# EAGLE schematic panelDoc (EAGLE 6.4)
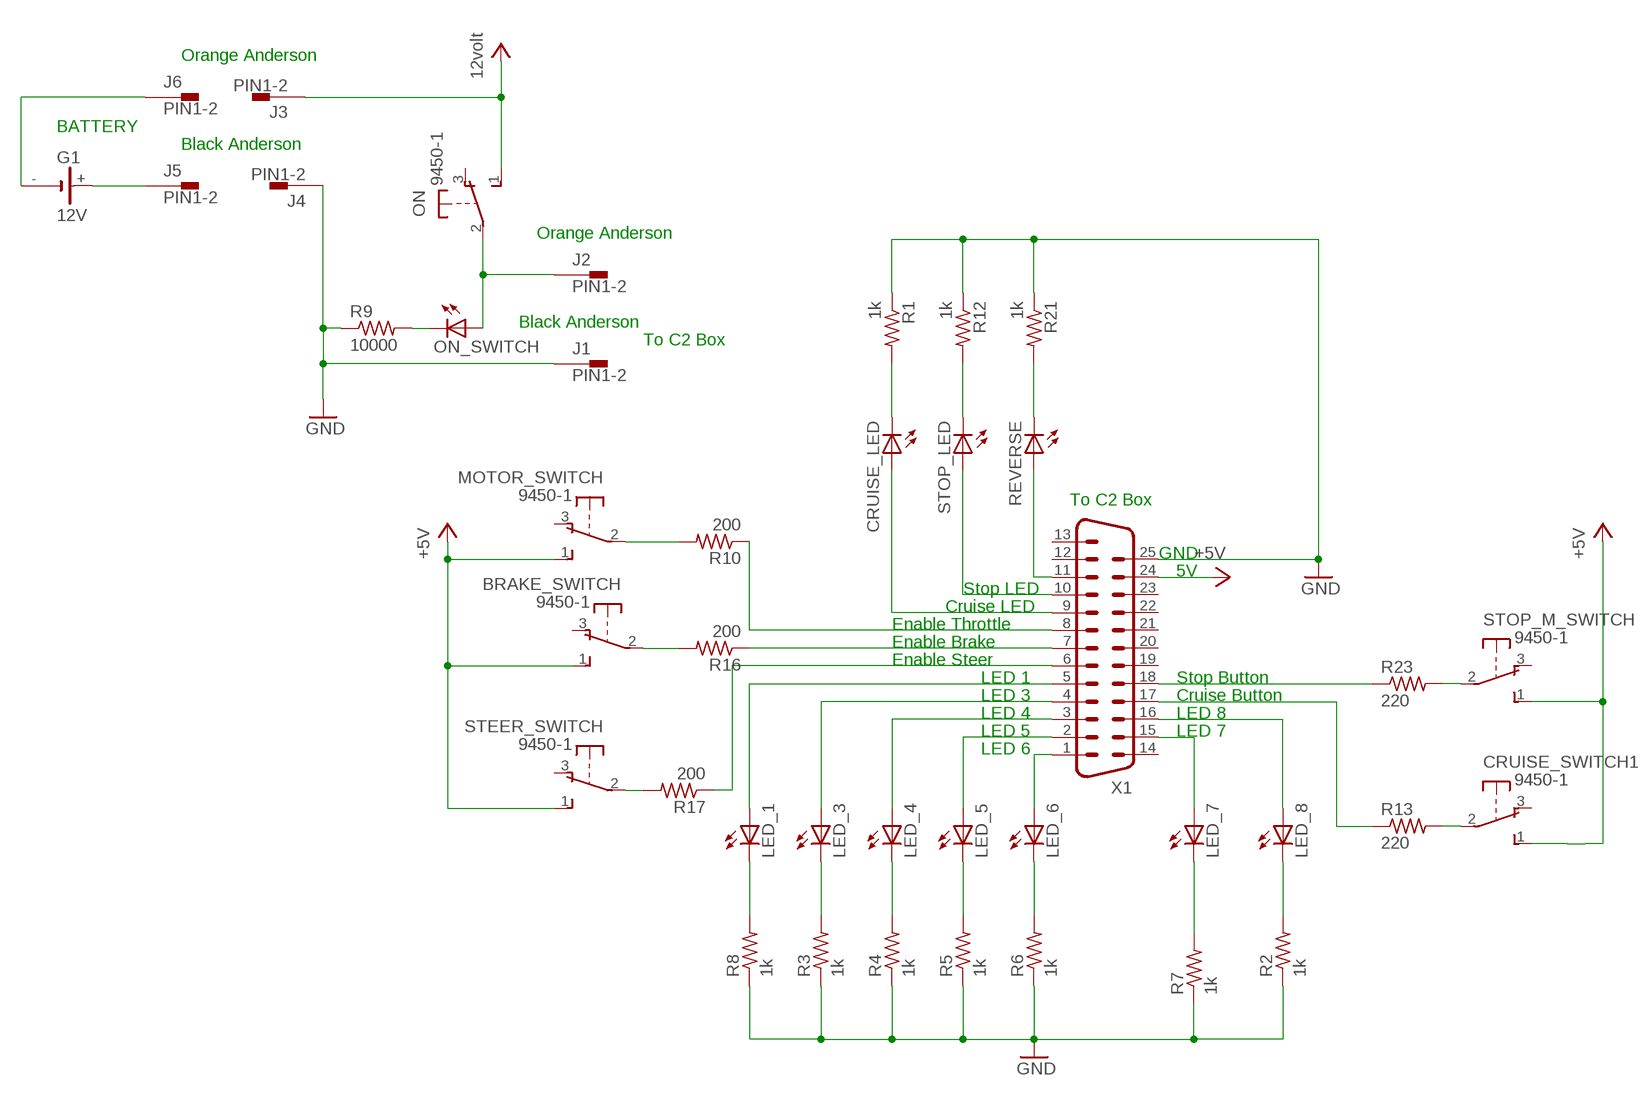
[diagram p0: schematic, sheet 1]

## Parts
BRAKE_SWITCH  9450-1  [9450-1]
CRUISE_LED  LEDB155  [Q62902-B155]
CRUISE_SWITCH1  9450-1  [9450-1]
G1  12V  SL-150-1/2AA/PT  [SL-150-1/2AA/PT]
J1  PIN1-2  [62221]
J2  PIN1-2  [62221]
J3  PIN1-2  [62221]
J4  PIN1-2  [62221]
J5  PIN1-2  [62221]
J6  PIN1-2  [62221]
LED_1  LEDB155  [Q62902-B155]
LED_3  LEDB155  [Q62902-B155]
LED_4  LEDB155  [Q62902-B155]
LED_5  LEDB155  [Q62902-B155]
LED_6  LEDB155  [Q62902-B155]
LED_7  LEDB155  [Q62902-B155]
LED_8  LEDB155  [Q62902-B155]
MOTOR_SWITCH  9450-1  [9450-1]
ON  9450-1  [9450-1]
ON_SWITCH  LEDB155  [Q62902-B155]
R1  1k  R-US_0617/17  [0617/17]
R2  1k  R-US_0617/17  [0617/17]
R3  1k  R-US_0617/17  [0617/17]
R4  1k  R-US_0617/17  [0617/17]
R5  1k  R-US_0617/17  [0617/17]
R6  1k  R-US_0617/17  [0617/17]
R7  1k  R-US_0617/17  [0617/17]
R8  1k  R-US_0617/17  [0617/17]
R9  10000  R-US_0617/17  [0617/17]
R10  200  R-US_0617/17  [0617/17]
R12  1k  R-US_0617/17  [0617/17]
R13  220  R-US_0617/17  [0617/17]
R16  200  R-US_0617/17  [0617/17]
R17  200  R-US_0617/17  [0617/17]
R21  1k  R-US_0617/17  [0617/17]
R23  220  R-US_0617/17  [0617/17]
REVERSE  LEDB155  [Q62902-B155]
STEER_SWITCH  9450-1  [9450-1]
STOP_LED  LEDB155  [Q62902-B155]
STOP_M_SWITCH  9450-1  [9450-1]
X1  M25-182  [182-025-MALE]

## Nets
+5V: BRAKE_SWITCH.1(S) CRUISE_SWITCH1.1(S) J3.1 MOTOR_SWITCH.1(S) ON.1(S) STEER_SWITCH.1(S) STOP_M_SWITCH.1(S) X1.24 ; supply symbol labelled 12volt
GND: J1.1 J4.1 R1.1 R2.1 R3.1 R4.1 R5.1 R6.1 R7.1 R8.1 R9.1 R12.1 R21.1 X1.25
N$1: R17.1 X1.6
N$2: LED_8.K(C) R2.2
N$3: CRUISE_LED.K(C) R1.2
N$4: LED_3.K(C) R3.2
N$5: LED_3.A X1.4
N$6: LED_4.K(C) R4.2
N$7: LED_4.A X1.3
N$8: LED_1.A X1.5
N$9: LED_8.A X1.16
N$10: LED_5.K(C) R5.2
N$11: LED_5.A X1.2
N$12: LED_6.K(C) R6.2
N$13: LED_6.A X1.1
N$14: LED_7.K(C) R7.2
N$15: CRUISE_LED.A X1.9
N$16: LED_1.K(C) R8.2
N$17: J2.1 ON.2(P) ON_SWITCH.A
N$18: ON_SWITCH.K(C) R9.2
N$19: R13.1 X1.17
N$20: LED_7.A X1.15
N$21: G1.- J6.1
N$22: REVERSE.A X1.11
N$23: G1.+ J5.1
N$25: R12.2 STOP_LED.K(C)
N$26: STOP_LED.A X1.10
N$27: MOTOR_SWITCH.2(P) R10.2
N$28: R10.1 X1.8
N$29: BRAKE_SWITCH.2(P) R16.2
N$30: R17.2 STEER_SWITCH.2(P)
N$32: R16.1 X1.7
N$34: CRUISE_SWITCH1.2(P) R13.2
N$35: R23.1 X1.18
N$37: R23.2 STOP_M_SWITCH.2(P)
REVERSE: R21.2 REVERSE.K(C)
Unconnected: BRAKE_SWITCH.3(O) CRUISE_SWITCH1.3(O) G1.-@1(-) MOTOR_SWITCH.3(O) ON.3(O) STEER_SWITCH.3(O) STOP_M_SWITCH.3(O) X1.12 X1.13 X1.14 X1.19 X1.20 X1.21 X1.22 X1.23

## Notes on the sheet
- Orange Anderson
- BATTERY
- Black Anderson
- Orange Anderson
- Black Anderson
- To C2 Box
- To C2 Box
- GND
- 5V
- Stop LED
- Cruise LED
- Enable Throttle
- Enable Brake
- Enable Steer
- LED 1 | Stop Button
- LED 3 | Cruise Button
- LED 4 | LED 8
- LED 5 | LED 7
- LED 6

## Library data of the parts
BRAKE_SWITCH CRUISE_SWITCH1 MOTOR_SWITCH ON STEER_SWITCH STOP_M_SWITCH = switch-misc:9450-1: MARQUARDT SWITCH
CRUISE_LED LED_1 LED_3-LED_8 ON_SWITCH REVERSE STOP_LED = led:LED: LED OSRAM: - CHIPLED LG R971, LG N971, LY N971, LG Q971, LY Q971, LO R971, LY R971 LH N974, LH R974 LS Q976, LO Q976, LY Q976 LO Q996 - Hyper CHIPLED LW Q18S LB Q993, LB Q99A, LB R99A - SideLED LS A670, LO A670, LY A670, LG A670, LP A670 LB A673, LV A673, LT A673, LW A673 LH A674 LY A675 LS A676, LA A676, LO A676, LY A676, LW A676 LS A679, LY A679, LG A679 - Hyper Micro SIDELED® LS Y876, LA Y876, LO Y876, LY Y876 LT Y87S - SmartLED LW L88C, LW L88S LB L89C, LB L89S, LG L890 LS L89K, LO L89K, LY L89K LS L896, LA L896, LO L896, LY L896 - TOPLED LS T670, LO T670, LY T670, LG T670, LP T670 LSG T670, LSP T670, LSY T670, LOP T670, LYG T670 LG T671, LOG T671, LSG T671 LB T673, LV T673, LT T673, LW T673 LH T674 LS T676, LA T676, LO T676, LY T676, LB T676, LH T676, LSB T676, LW T676 LB T67C, LV T67C, LT T67C, LS T67K, LO T67K, LY T67K, LW E67C LS E67B, LA E67B, LO E67B, LY E67B, LB E67C, LV E67C, LT E67C LW T67C LS T679, LY T679, LG T679 LS T770, LO T770, LY T770, LG T770, LP T770 LB T773, LV T773, LT T773, LW T773 LH T774 LS E675, LA E675, LY E675, LS T675 LS T776, LA T776, LO T776, LY T776, LB T776 LHGB T686 LT T68C, LB T68C - Hyper Mini TOPLED® LB M676 - Mini TOPLED Santana® LG M470 LS M47K, LO M47K, LY M47K Source: http://www.osram.convergy.de LUXEON: - LUMILED® LXK2-PW12-R00, LXK2-PW12-S00, LXK2-PW14-U00, LXK2-PW14-V00 LXK2-PM12-R00, LXK2-PM12-S00, LXK2-PM14-U00 LXK2-PE12-Q00, LXK2-PE12-R00, LXK2-PE12-S00, LXK2-PE14-T00, LXK2-PE14-U00 LXK2-PB12-K00, LXK2-PB12-L00, LXK2-PB12-M00, LXK2-PB14-N00, LXK2-PB14-P00, LXK2-PB14-Q00 LXK2-PR12-L00, LXK2-PR12-M00, LXK2-PR14-Q00, LXK2-PR14-R00 LXK2-PD12-Q00, LXK2-PD12-R00, LXK2-PD12-S00 LXK2-PH12-R00, LXK2-PH12-S00 LXK2-PL12-P00, LXK2-PL12-Q00, LXK2-PL12-R00 Source: www.luxeon.com KINGBRIGHT: KA-3528ASYC Source: www.kingbright.com
G1 = battery:SL-150-1/2AA/PT: LI BATTERY Sonnenschein
J1-J6 = con-faston:PIN1-2: CONN TAB FASTON BRASS .187 PCB TAB, FSSTON, DUAL STAKE, .187 SERIES Digi-Key Part Number: A24734CT-ND Source: Tyco Electronics Corporation .. ENG_CD_62221_R.pdf http://search.digikey.com/scripts/DkSearch/dksus.dll?Detail&name=A24734CT-ND; MF: TYCO ELECTRONICS; MPN: 62221-1; OC_FARNELL: unknown; OC_NEWARK: 16H2318
R1-R10 R12 R13 R16 R17 R21 R23 = resistor:R-US_: RESISTOR, American symbol
X1 = con-subd:M25: SUB-D; OC_FARNELL: unknown; OC_NEWARK: unknown